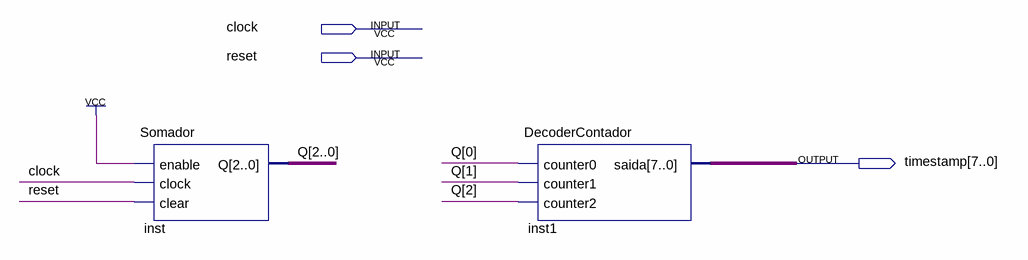
[diagram p0: schematic sheet]
// Quartus schematic Temporizador.bdf as structural Verilog: 2 symbols, 3 pins
module Temporizador (
  input  clock,
  input  reset,
  output [7:0] timestamp
);

  wire [2:0] Q;

  Somador inst (.enable(1'b1), .clock(clock), .clear(reset), .Q(Q));
  DecoderContador inst1 (.counter0(Q[0]), .counter1(Q[1]), .counter2(Q[2]), .saida(timestamp));
endmodule
